# EAGLE schematic MagicQCtrlPadEncoderCircuit_v3 (EAGLE 9.7.0)
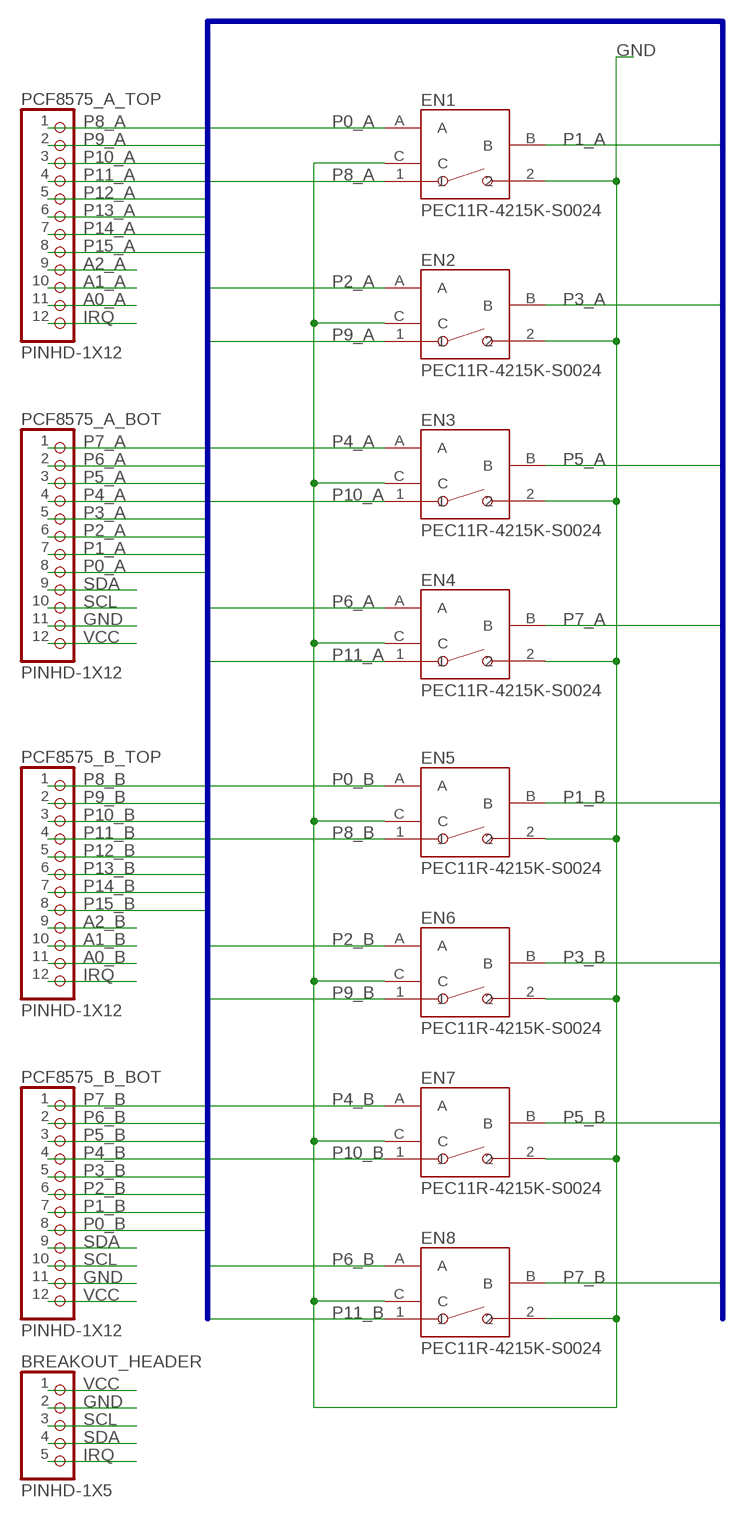
[diagram p0: schematic, sheet 1]

## Parts
BREAKOUT_HEADER  PINHD-1X5  [1X05]
EN1  PEC11R-4215K-S0024  [PEC11R-4215K-S0024]
EN2  PEC11R-4215K-S0024  [PEC11R-4215K-S0024]
EN3  PEC11R-4215K-S0024  [PEC11R-4215K-S0024]
EN4  PEC11R-4215K-S0024  [PEC11R-4215K-S0024]
EN5  PEC11R-4215K-S0024  [PEC11R-4215K-S0024]
EN6  PEC11R-4215K-S0024  [PEC11R-4215K-S0024]
EN7  PEC11R-4215K-S0024  [PEC11R-4215K-S0024]
EN8  PEC11R-4215K-S0024  [PEC11R-4215K-S0024]
PCF8575_A_BOT  PINHD-1X12  [1X12]
PCF8575_A_TOP  PINHD-1X12  [1X12]
PCF8575_B_BOT  PINHD-1X12  [1X12]
PCF8575_B_TOP  PINHD-1X12  [1X12]

## Nets
A0_A: PCF8575_A_TOP.11
A0_B: PCF8575_B_TOP.11
A1_A: PCF8575_A_TOP.10
A1_B: PCF8575_B_TOP.10
A2_A: PCF8575_A_TOP.9
A2_B: PCF8575_B_TOP.9
GND [power]: BREAKOUT_HEADER.2 EN1.2 EN1.C EN2.2 EN2.C EN3.2 EN3.C EN4.2 EN4.C EN5.2 EN5.C EN6.2 EN6.C EN7.2 EN7.C EN8.2 EN8.C PCF8575_A_BOT.11 PCF8575_B_BOT.11
IRQ: BREAKOUT_HEADER.5 PCF8575_A_TOP.12 PCF8575_B_TOP.12
P0_A: EN1.A PCF8575_A_BOT.8
P0_B: EN5.A PCF8575_B_BOT.8
P1_A: EN1.B PCF8575_A_BOT.7
P1_B: EN5.B PCF8575_B_BOT.7
P2_A: EN2.A PCF8575_A_BOT.6
P2_B: EN6.A PCF8575_B_BOT.6
P3_A: EN2.B PCF8575_A_BOT.5
P3_B: EN6.B PCF8575_B_BOT.5
P4_A: EN3.A PCF8575_A_BOT.4
P4_B: EN7.A PCF8575_B_BOT.4
P5_A: EN3.B PCF8575_A_BOT.3
P5_B: EN7.B PCF8575_B_BOT.3
P6_A: EN4.A PCF8575_A_BOT.2
P6_B: EN8.A PCF8575_B_BOT.2
P7_A: EN4.B PCF8575_A_BOT.1
P7_B: EN8.B PCF8575_B_BOT.1
P8_A: EN1.1 PCF8575_A_TOP.1
P8_B: EN5.1 PCF8575_B_TOP.1
P9_A: EN2.1 PCF8575_A_TOP.2
P9_B: EN6.1 PCF8575_B_TOP.2
P10_A: EN3.1 PCF8575_A_TOP.3
P10_B: EN7.1 PCF8575_B_TOP.3
P11_A: EN4.1 PCF8575_A_TOP.4
P11_B: EN8.1 PCF8575_B_TOP.4
P12_A: PCF8575_A_TOP.5
P12_B: PCF8575_B_TOP.5
P13_A: PCF8575_A_TOP.6
P13_B: PCF8575_B_TOP.6
P14_A: PCF8575_A_TOP.7
P14_B: PCF8575_B_TOP.7
P15_A: PCF8575_A_TOP.8
P15_B: PCF8575_B_TOP.8
SCL: BREAKOUT_HEADER.3 PCF8575_A_BOT.10 PCF8575_B_BOT.10
SDA: BREAKOUT_HEADER.4 PCF8575_A_BOT.9 PCF8575_B_BOT.9
VCC [power]: BREAKOUT_HEADER.1 PCF8575_A_BOT.12 PCF8575_B_BOT.12

## Buses
P0_A,P0_B,P1_A,P1_B,P2_A,P2_B,P3_A,P3_B,P4_A,P4_B,P5_A,P5_B,P6_A,P6_B,P7_A,P7_B,P8_A,P8_B,P9_A,P9_B,P10_A,P10_B,P11_A,P11_B,P12_A,P12_B,P13_A,P13_B,P14_A,P14_B,P15_A,P15_B

## Library data of the parts
BREAKOUT_HEADER = Connector:PINHD-1X5: PIN HEADER; CATEGORY: CONNECTOR; SUB-CATEGORY: PIN-HEADER
EN1-EN8 = Encoders:PEC11R-4215K-S0024: ROTARY ENCODER MECHANICAL 24PPR Manufacturer's datasheet <https://www.bourns.com/docs/Product-Datasheets/PEC11R.pdf>; CREATED_BY: PCBLayout.com; DIGIKEY_PARTNO: PEC11R-4215K-S0024-ND; MANUFACTURER: Bourns Inc.; MPN: PEC11R-4215K-S0024
PCF8575_A_BOT PCF8575_A_TOP PCF8575_B_BOT PCF8575_B_TOP = Connector:PINHD-1X12: PIN HEADER; CATEGORY: CONNECTOR; SUB-CATEGORY: PIN-HEADER

## Net classes
1 power: width 0.508 mm